# EasyEDA Pro project ProPrj_三轮车_2025-08-24.epro, board PCB2
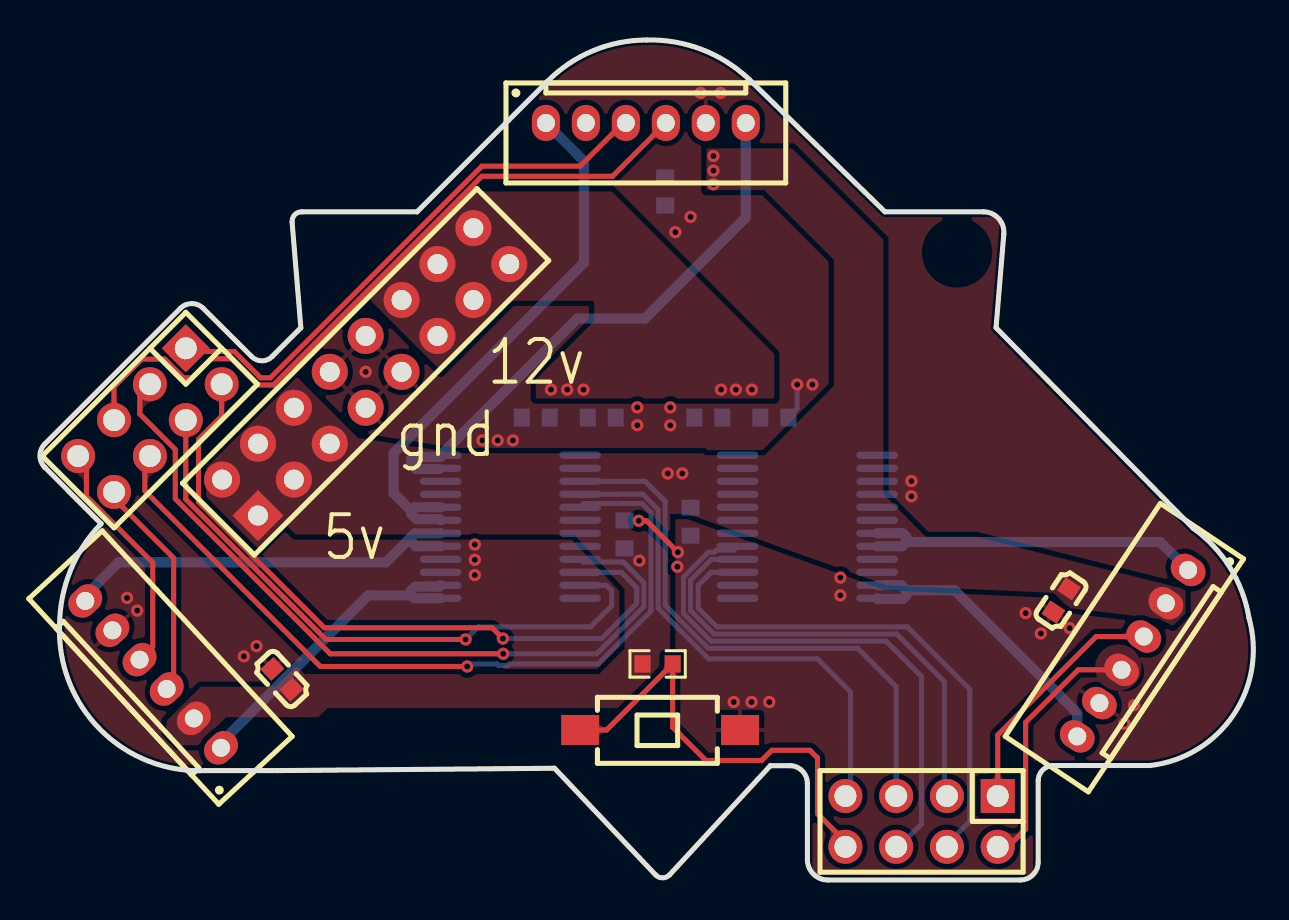
[diagram p8: board, top side]
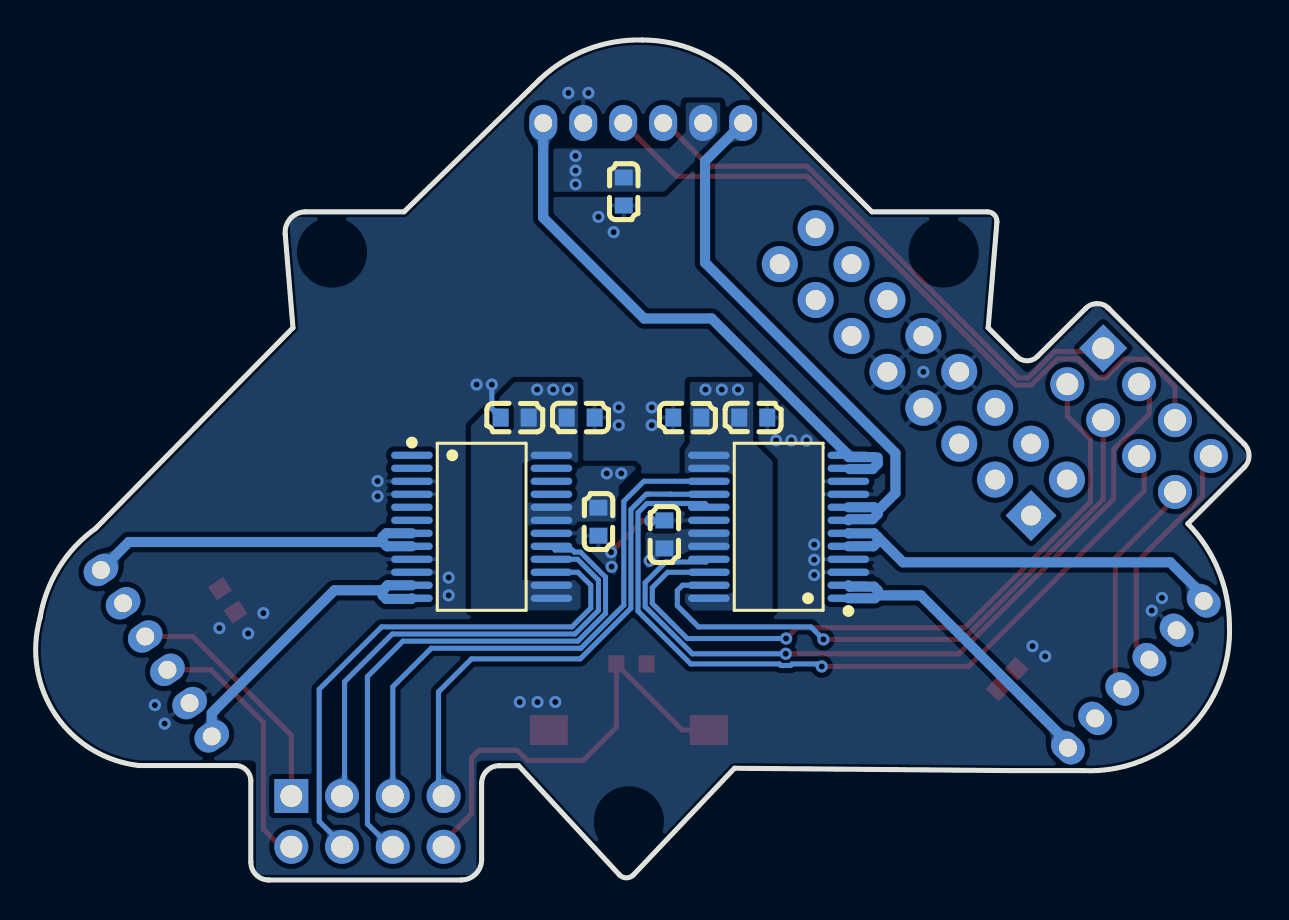
[diagram p9: board, bottom side, seen from below]

Outline 60.71 x 42 mm; copper layers: Top Layer, Bottom Layer. Coordinates in mm from the lower left corner of the outline.
Outline path: 0.24,21.8 7.02,28.58 arc(7.6,28.82) 8.17,28.58 10.59,26.17 arc(11.1,25.96) 11.61,26.17 13.05,27.61 12.61,32.89 arc(12.74,33.26) 13.09,33.41 18.87,33.41 25.39,39.94 arc(27.67,41.46) 30.36,42 arc(33.12,41.53) 35.48,40.03 42.28,33.41 47.21,33.41 arc(47.96,33.08) 48.22,32.31 47.83,27.61 57.7,17.59 arc(59.54,15.62) 60.49,13.09 arc(59.72,8.26) 55.54,5.72 50.71,5.72 arc(50.17,5.5) 49.94,4.95 49.94,0.89 arc(49.68,0.26) 49.05,0 39.42,0 arc(38.69,0.3) 38.4,1.02 38.4,4.83 arc(38.14,5.46) 37.51,5.72 36.54,5.72 31.51,0.26 arc(31.15,0.11) 30.8,0.26 25.75,5.59 11.88,5.47 8.29,5.47 arc(3.03,7.51) 0.98,12.77 arc(1.53,15.49) 3.06,17.82 0.24,20.63 arc(0,21.22) 0.24,21.8
Stack: Top Layer 0.035mm / Dielectric1 1.51mm FR4 er 4.5 / Bottom Layer 0.035mm

## Design rules (mm)
template: 自定义配置
spacing copperThickness1oz (default): track to track 0.102, other pairs 0.152 to 0.3
spacing copperThickness2oz: track to track 0.203, other pairs 0.152 to 0.3
track width copperThickness1oz (default): min 0.127, default 0.254, max 2.54
track width copperThickness2oz: min 0.203, default 0.254, max 2.54
differential pair differentialPair (default): width min 0.127, default 0.254, max 2.54; gap min 0.152, default 0.152
via viaSize (default): diameter min 0.5, default 0.61, max 10; hole min 0.3, default 0.305, max 6.3
net 12V uses AS
net 5V2A uses AS

## Placement (name value [footprint] x y rotation side)
C33  100nF  [C0603]  24.8 23.12 180 bottom
C34  10uF  [C0603]  33.44 23.12 180 bottom
C35  100nF  [C0603]  29.25 17.28 90 bottom
C48  100nF  [C0603]  51.09 13.98 56.3 top
C49  100nF  [C0603]  31.28 34.43 90 bottom
C57  100nF  [C0603]  36.74 23.12 0 bottom
C58  10uF  [C0603]  28.11 23.12 0 bottom
C59  100nF  [C0603]  32.55 17.92 270 bottom
C60  100nF  [C0603]  12.1 10.04 312.8 top
CN1  PH2.0-6P  [PH2.0-6P 直针端子座]  57.44 15.5 236.3 top
CN3  PH2.0-6P  [PH2.0-6P 直针端子座]  25.31 37.86 0 top
CN4  PH2.0-6P  [PH2.0-6P 直针端子座]  9.06 6.61 132.8 top
H9  PZ254V-12-8P  [HDR-TH_8P-P2.54-V-M-R2-C4-S2.54]  5.5 23 225 top
H10  PZ254V-12-8P  [HDR-TH_8P-P2.54-V-M-R2-C4-S2.54]  44.11 2.93 180 top
J2  2.54-2*8P母  [HDR-TH_16P-P2.54-V-F-R2-C8-S2.54]  16.3 25.41 45 top
R29  10kΩ  [R0603]  30.9 10.8 180 top
SW7  TS-1101-C-W  [SW-SMD_L6.0-W3.3-LS8.0]  31.03 7.5 0 top
U28  TB6612FNG(O,C,8,EL  [SSOP-24_L8.4-W5.8-P0.65-LS7.8-BL]  38.39 17.66 270 bottom
U29  TB6612FNG(O,C,8,EL  [SSOP-24_L8.4-W5.8-P0.65-LS7.8-BL]  23.53 17.66 90 bottom

## Footprints (pads in the part's own frame, mm; a bottom-side part is the same pattern mirrored in y, then rotated)
C0603
  rect 0.8x0.9 smd: 1(-0.7,0) 2(0.7,0)
HDR-TH_8P-P2.54-V-M-R2-C4-S2.54
  rect 1.7x1.7 hole 1.1: 1(-3.81,-1.27)
  round 1.7 hole 1.1: 2(-3.81,1.27) 3(-1.27,-1.27) 4(-1.27,1.27) 5(1.27,-1.27) 6(1.27,1.27) 7(3.81,-1.27) 8(3.81,1.27)
HDR-TH_16P-P2.54-V-F-R2-C8-S2.54
  rect 1.8x1.8 hole 1: 1(-8.89,-1.27)
  round 1.8 hole 1: 2(-8.89,1.27) 3(-6.35,-1.27) 4(-6.35,1.27) 5(-3.81,-1.27) 6(-3.81,1.27) 7(-1.27,-1.27) 8(-1.27,1.27) 9(1.27,-1.27) 10(1.27,1.27) 11(3.81,-1.27) 12(3.81,1.27) 13(6.35,-1.27) 14(6.35,1.27) 15(8.89,-1.27) 16(8.89,1.27)
PH2.0-6P 直针端子座
  oval 1.4x1.8 hole 0.9: 1(0,0) 2(2,0) 3(4,0) 4(6,0) 5(8,0) 6(10,0)
R0603
  rect 0.806x0.864 smd: 1(-0.753,0) 2(0.753,0)
SSOP-24_L8.4-W5.8-P0.65-LS7.8-BL
  oval 0.364x2.082 smd: 1(-3.575,-3.491) 2(-2.925,-3.491) 3(-2.275,-3.491) 4(-1.625,-3.491) 5(-0.975,-3.491) 6(-0.325,-3.491) 7(0.325,-3.491) 8(0.975,-3.491) 9(1.625,-3.491) 10(2.275,-3.491) 11(2.925,-3.491) 12(3.575,-3.491) 13(3.575,3.491) 14(2.925,3.491) 15(2.275,3.491) 16(1.625,3.491) 17(0.975,3.491) 18(0.325,3.491) 19(-0.325,3.491) 20(-0.975,3.491) 21(-1.625,3.491) 22(-2.275,3.491) 23(-2.925,3.491) 24(-3.575,3.491)
SW-SMD_L6.0-W3.3-LS8.0
  rect 1.9x1.5 smd: 1(-4,0) 2(4,0)

## Nets
As in the schematic.

Pads without a net: U28 1 2 5 6 21 22 23

## Via types
v1: diameter 0.61, hole 0.305, Top Layer to Bottom Layer, 52 vias

## Routing (per net, layer and track width the routed paths; a pad name or vN(x,y) marks a point on that pad's centre or on a via; arc(x,y) is an arc through that point)
5V2A:
  vias: v1(29.99,15.97) v1(31.41,20.33) v1(32.14,20.33) v1(33.69,36.2) v1(33.69,35.47) v1(33.69,34.78)
12V:
  vias: v1(25.57,24.52) v1(26.38,24.52) v1(27.2,24.52) v1(34.08,24.52) v1(34.81,24.52) v1(35.62,24.52)
GND: length 4.4
  Top Layer w0.254: v1(31.92,16.39) 30.35,17.96 v1(29.96,17.96)
  Bottom Layer w0.254: v1(37.89,24.77) 37.89,23.57 C57.2
  vias: v1(4.36,14.11) v1(4.87,13.47) v1(10.2,11.19) v1(10.83,11.69) v1(16.3,25.41) v1(21.76,16.77) v1(21.76,16.01) v1(21.76,15.25) v1(22.14,21.98) v1(22.9,21.98) v1(23.66,21.98) v1(29.88,23.63) v1(29.88,22.74) v1(31.54,23.63) v1(31.54,22.74) v1(31.79,32.39) v1(31.89,15.66) v1(32.55,33.16) v1(33.05,39.36) v1(34.05,39.36) v1(34.71,8.9) v1(35.6,8.9) v1(36.49,8.9) v1(38.65,24.77) v1(40.04,15.12) v1(40.04,14.23) v1(43.6,19.95) v1(43.6,19.19) v1(49.32,13.34) v1(50.08,12.33) v1(51.52,12.6) v1(54.25,7.82) v1(54.74,8.75)
AM1: length 27.8
  Bottom Layer w0.508: 18.58,18.46 17.69,19.35 17.69,21.34 27.22,30.87 27.22,35.95 CN3.1 ; 18.58,18.46 18.58,18.3 18.84,18.04 19.99,18.04 U29.7 ; 18.58,18.46 18.76,18.64 U29.8
AM2: length 28.3
  Bottom Layer w0.508: CN3.6 35.31,33.12 30.27,28.08 26.88,28.08 U29.12 ; 19.99,20.55 18.84,20.55 18.58,20.8 18.58,20.96 ; 18.58,20.96 18.76,21.14 20.04,21.14 ; 18.58,20.96 18.58,21.12
BM1: length 18
  Bottom Layer w0.508: U28.7 43.16,17.34 43.35,17.15 43.35,16.9 ; 43.35,16.9 56.05,16.9 CN1.1 ; 43.35,16.9 43.13,16.69 U28.8
BM2: length 15.6
  Bottom Layer w0.508: U28.12 41.92,14.05 43.17,14.05 43.35,14.23 43.35,14.49 ; 43.35,14.49 43.1,14.74 U28.11 ; 43.35,14.49 45.76,14.49 51.73,8.51 51.73,8.5 51.9,8.34 CN1.6
CM1: length 21.1
  Bottom Layer w0.508: 18.58,17.15 18.76,17.33 20.04,17.33 U29.6 ; 18.58,17.15 17.31,15.88 3.94,15.88 2.27,14.21 CN4.6 ; 18.58,17.15 18.58,16.9 18.79,16.69 U29.5
CM2: length 16.3
  Bottom Layer w0.508: 8.68,6.87 9.06,6.87 16.42,14.23 18.58,14.23 ; U29.2 19.97,14.67 18.76,14.67 18.58,14.49 18.58,14.23 ; 18.58,14.23 18.73,14.09 U29.1
PA0: length 10.4
  Top Layer w0.254: 6.58,10.28 6.69,10.38 6.69,16.09 3.7,19.08 H9.8
PA1: length 12
  Top Layer w0.254: CN4.4 5.64,11.68 5.64,15.87 2.33,19.19 2.33,20.78 H9.7
PA4: length 22.5
  Top Layer w0.254: H10.8 40.3,1.91 38.9,3.31 38.9,6.11 38.52,6.49 36.62,6.49 36.11,5.98 33.31,5.98 31.65,7.64 R29.1 28.35,7.5 SW7.1
PA15: length 27.9
  Top Layer w0.254: H9.1 7.46,26.43 9.72,26.43 11.04,25.11 11.53,25.11 22.11,35.7 27.03,35.7 29.19,37.86 CN3.3
PB3: length 36.6
  Top Layer w0.254: CN3.4 28.65,35.19 22.11,35.19 11.67,24.75 10.89,24.75 9.58,26.06 8.57,26.06 7.61,25.11 7.18,25.11 6.24,26.04 5.09,26.04 3.7,24.66 H9.5
PB8: length 31.3
  Top Layer w0.254: v1(21.29,12.03) 14.3,12.03 7.3,19.04 H9.4
  Bottom Layer w0.254: v1(21.29,12.03) 21.92,12.66 27.55,12.66 28.6,13.71 28.6,14.48 28.34,14.74 U29.23
PB11: length 25.8
  Bottom Layer w0.254: U29.16 28.93,19.29 28.94,19.3 30.07,19.3 30.08,19.29 30.16,19.29 30.93,18.53 30.93,13.59 33.46,11.06 38.9,11.06 40.55,9.41 40.55,4.45 H10.7
PB12: length 27.5
  Bottom Layer w0.254: H10.6 42.97,1.66 44.11,2.8 44.11,10.17 42.33,11.94 33.58,11.94 32.2,13.33 32.2,15.14 33.45,16.39 33.75,16.39 33.85,16.5 34.71,16.5 U28.17
PB15: length 24.2
  Bottom Layer w0.254: U28.16 33.59,16.04 32.55,15 32.55,13.48 33.73,12.3 42.87,12.3 45.25,9.92 45.25,4.33 H10.3
PC2: length 39.2
  Top Layer w0.254: v1(23.18,11.31) 14.52,11.31 6.77,19.06 6.77,21.53 4.99,23.3 4.99,24.28 H9.3
  Bottom Layer w0.254: U29.21 27.16,15.9 29.18,15.9 30.21,14.87 30.21,13.67 27.85,11.31 v1(23.18,11.31)
PC3: length 40.8
  Top Layer w0.254: H9.6 5.25,20.95 5.25,19.46 14.03,10.68 v1(21.38,10.68)
  Bottom Layer w0.254: v1(21.38,10.68) 21.5,10.8 22.86,10.8 22.94,10.73 23.42,10.73 23.5,10.8 27.93,10.8 30.57,13.44 30.57,18.38 30.12,18.83 27.21,18.83 U29.17
PC6: length 12.4
  Top Layer w0.254: CN1.3 52.84,12.17 47.92,7.25 H10.1
PC7: length 13
  Top Layer w0.254: 54.12,10.51 51.94,10.51 49.32,7.88 49.32,2.55 48.43,1.66 H10.2
PC8: length 27
  Bottom Layer w0.254: H10.4 45.38,1.79 46.52,2.93 46.52,9.53 43.4,12.66 33.87,12.66 32.93,13.6 32.93,14.74 33.58,15.39 U28.15
PC9: length 28.6
  Bottom Layer w0.254: U29.15 30.28,19.94 31.28,18.93 31.28,13.74 33.43,11.59 40.91,11.59 42.84,9.66 H10.5
PD2: length 35.8
  Top Layer w0.254: v1(23.16,12.07) 22.62,12.61 14.22,12.61 7.93,18.9 7.93,22.04 9.09,23.2 H9.2
  Bottom Layer w0.254: U29.22 29.08,15.39 29.86,14.61 29.86,13.83 28.11,12.07 v1(23.16,12.07)

## Copper pours and planes (outline as drawn; the poured copper is in the pictures)
5V2A on Top Layer: 33.29,21.24 33.19,21.35 20.79,21.35 15.91,22.11 12.87,25.16 8.12,20.41 8.04,19.44 10.95,16.53 10.95,16.47 12.27,17.79 12.78,17.27 26.72,17.27 29.25,14.54 29.25,11.57 27.98,10.3 13.24,10.3 12.83,10.7 11.79,9.66 8.04,9.66 6.33,7.95 6.33,7.35 6.94,6.74 7.91,6.74 9.31,8.14 13.93,8.14 14.39,8.6 30.33,8.6 31.54,9.8 31.54,18.3 32.44,18.3 42.37,14.74 50.71,14.36 51.47,13.6 55.98,13.06 56.68,12.71 57.32,13.34 57.32,14.54 46.85,17.15 44.34,17.15 42.2,19.29 42.2,32.01 37.63,36.59 33.34,36.59 33.34,34.5 36.18,34.5 36.23,34.55 36.23,34.5 39.72,31.01 39.72,24.7 36.25,21.24
5V2A on Bottom Layer: 30.52,14.87 30.52,17.54 28.18,17.54 28.16,17.56 25.93,17.56 25.93,16.31 28.31,16.31 28.36,16.27 29.12,16.27
5V2A on Bottom Layer: 34.92,34.41 29.26,34.42 26.46,37.22 26.46,38.87 28.18,38.87 28.18,37.4 29,36.59 34.92,36.59
5V2A on Bottom Layer: 30.65,20.58 31.54,19.69 31.54,17.92 33.6,17.92 33.6,17.88 33.82,17.66 34.84,17.66 34.96,17.54 35.98,17.54 36.11,17.66 36.11,18.81 35.98,18.93 33.82,18.93 33.82,20.46 33.57,20.71 30.77,20.71
12V on Top Layer: 21.88,34.43 16.55,29.09 16.55,28.97 20.04,25.47 20.04,25.41 23.6,28.97 27.73,28.97 27.73,27.95 24.8,25.03 24.8,24.08 36.74,24.08 36.74,26.3 28.61,34.43
12V on Bottom Layer: 28.23,13.47 23.83,13.47 23.83,20.93 24.8,21.9 24.8,24.9 27.98,24.9 27.98,21.87 28.23,21.47 28.23,20.2 25.76,20.2 25.76,14.42 25.82,14.36 28.22,14.36 28.23,14.35
12V on Bottom Layer: 33.47,13.49 38.93,13.49 38.93,22.7 36.74,24.9 33.57,24.9 33.57,20.84 36.36,20.84 36.36,15 33.44,15 33.44,13.51
GND on Top Layer: -21.8,52.21 62.78,52.21 69.64,45.35 69.64,-12.06 69.13,-12.56 -9.36,-12.56 -21.8,-0.12
GND on Bottom Layer: -7.71,47 75.99,47 83.86,39.13 83.86,-5.58 1.69,-5.58 -0.34,-7.61 -12.28,-7.61 -12.91,-6.98 -12.91,41.79

Small or netless copper shapes (teardrops, artwork), in the pictures only: 20 on Top Layer, 19 on Bottom Layer

## Text on the board
Top Silkscreen Layer: 5v | gnd | 12v
